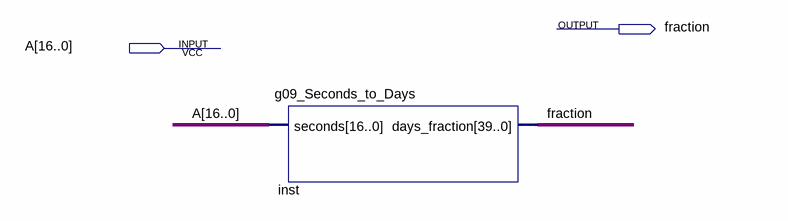
[diagram p0: schematic sheet]
// Quartus schematic g09_lab1_daysfraction.bdf as structural Verilog: 1 symbols, 2 pins
module g09_lab1_daysfraction (
  input  [16:0] A,
  output fraction
);

  g09_Seconds_to_Days inst (.seconds(A), .days_fraction(fraction));
endmodule
